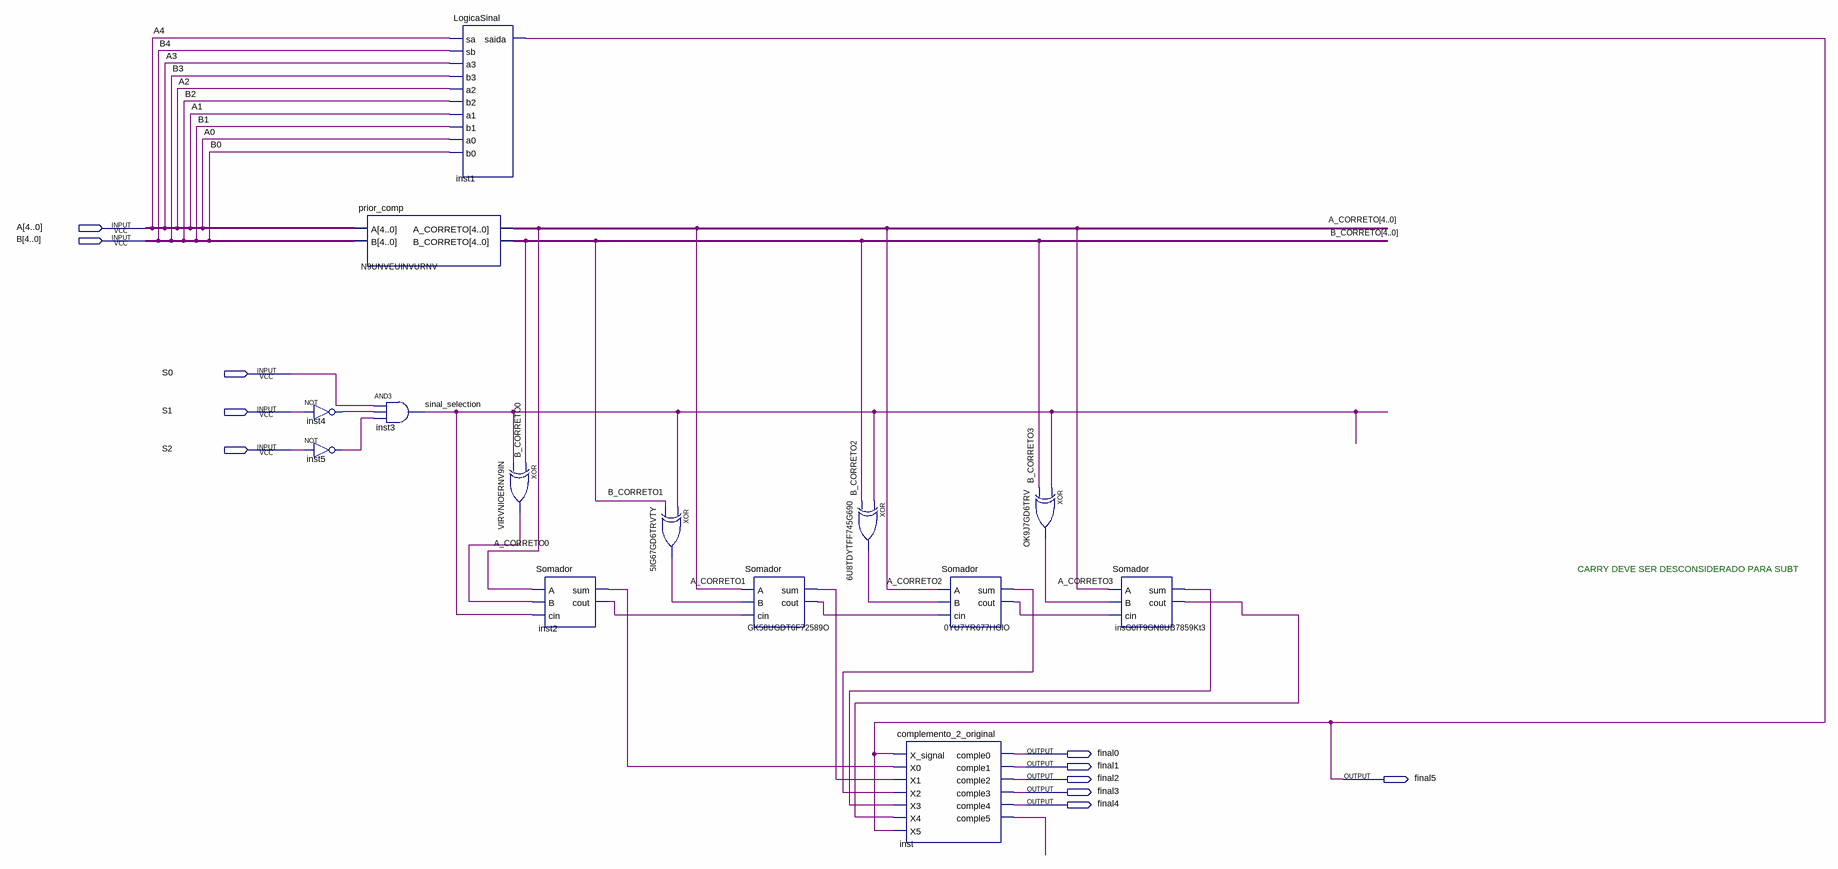
[diagram p0: schematic sheet]
// Quartus schematic somador_overflow.bdf as structural Verilog: 14 symbols, 11 pins
module somador_overflow (
  input  [4:0] A,
  input  [4:0] B,
  input  S0,
  input  S1,
  input  S2,
  output final0,
  output final1,
  output final2,
  output final5,
  output final3,
  output final4
);

  wire GK58UGDT6F72589O_cout, GK58UGDT6F72589O_sum, insG0IT9GN8UB7859Kt3_cout, insG0IT9GN8UB7859Kt3_sum,
       inst2_cout, inst2_sum, inst4_out, inst5_out, inst_comple5, n0YU7YR677HGIO_cout, n0YU7YR677HGIO_sum,
       n5IG67GD6TRVTY_out, n6U8TDYTFF745G690_out, OK9J7GD6TRV_out, sinal_selection, VIRVNIOERNV9IN_out;
  wire [4:0] A_CORRETO, B_CORRETO;

  not inst4 (inst4_out, S1);
  not inst5 (inst5_out, S2);
  prior_comp N9UNVEUINVURNV (.A(A), .B(B), .A_CORRETO(A_CORRETO), .B_CORRETO(B_CORRETO));
  and inst3 (sinal_selection, S0, inst4_out, inst5_out);
  LogicaSinal inst1 (
    .sa(A[4]), .sb(B[4]), .a3(A[3]), .b3(B[3]), .a2(A[2]), .b2(B[2]), .a1(A[1]), .b1(B[1]), .a0(A[0]),
    .b0(B[0]), .saida(final5));
  xor VIRVNIOERNV9IN (VIRVNIOERNV9IN_out, B_CORRETO[0], sinal_selection);
  Somador inst2 (.A(A_CORRETO[0]), .B(VIRVNIOERNV9IN_out), .cin(sinal_selection), .sum(inst2_sum), .cout(inst2_cout));
  xor u_5IG67GD6TRVTY (n5IG67GD6TRVTY_out, sinal_selection, B_CORRETO[1]);
  Somador GK58UGDT6F72589O (
    .A(A_CORRETO[1]), .B(n5IG67GD6TRVTY_out), .cin(inst2_cout), .sum(GK58UGDT6F72589O_sum),
    .cout(GK58UGDT6F72589O_cout));
  xor u_6U8TDYTFF745G690 (n6U8TDYTFF745G690_out, sinal_selection, B_CORRETO[2]);
  complemento_2_original inst (
    .X_signal(final5), .X0(inst2_sum), .X1(GK58UGDT6F72589O_sum), .X2(n0YU7YR677HGIO_sum),
    .X3(insG0IT9GN8UB7859Kt3_sum), .X4(insG0IT9GN8UB7859Kt3_cout), .X5(final5), .comple0(final0),
    .comple1(final1), .comple2(final2), .comple3(final3), .comple4(final4), .comple5(inst_comple5));
  Somador u_0YU7YR677HGIO (
    .A(A_CORRETO[2]), .B(n6U8TDYTFF745G690_out), .cin(GK58UGDT6F72589O_cout), .sum(n0YU7YR677HGIO_sum),
    .cout(n0YU7YR677HGIO_cout));
  xor OK9J7GD6TRV (OK9J7GD6TRV_out, sinal_selection, B_CORRETO[3]);
  Somador insG0IT9GN8UB7859Kt3 (
    .A(A_CORRETO[3]), .B(OK9J7GD6TRV_out), .cin(n0YU7YR677HGIO_cout), .sum(insG0IT9GN8UB7859Kt3_sum),
    .cout(insG0IT9GN8UB7859Kt3_cout));

  // Notes on the sheet:
  //   CARRY DEVE SER DESCONSIDERADO PARA SUBT
endmodule
